# EAGLE design 2019_Dashboard_2_4_19 (EAGLE 9.1.0)
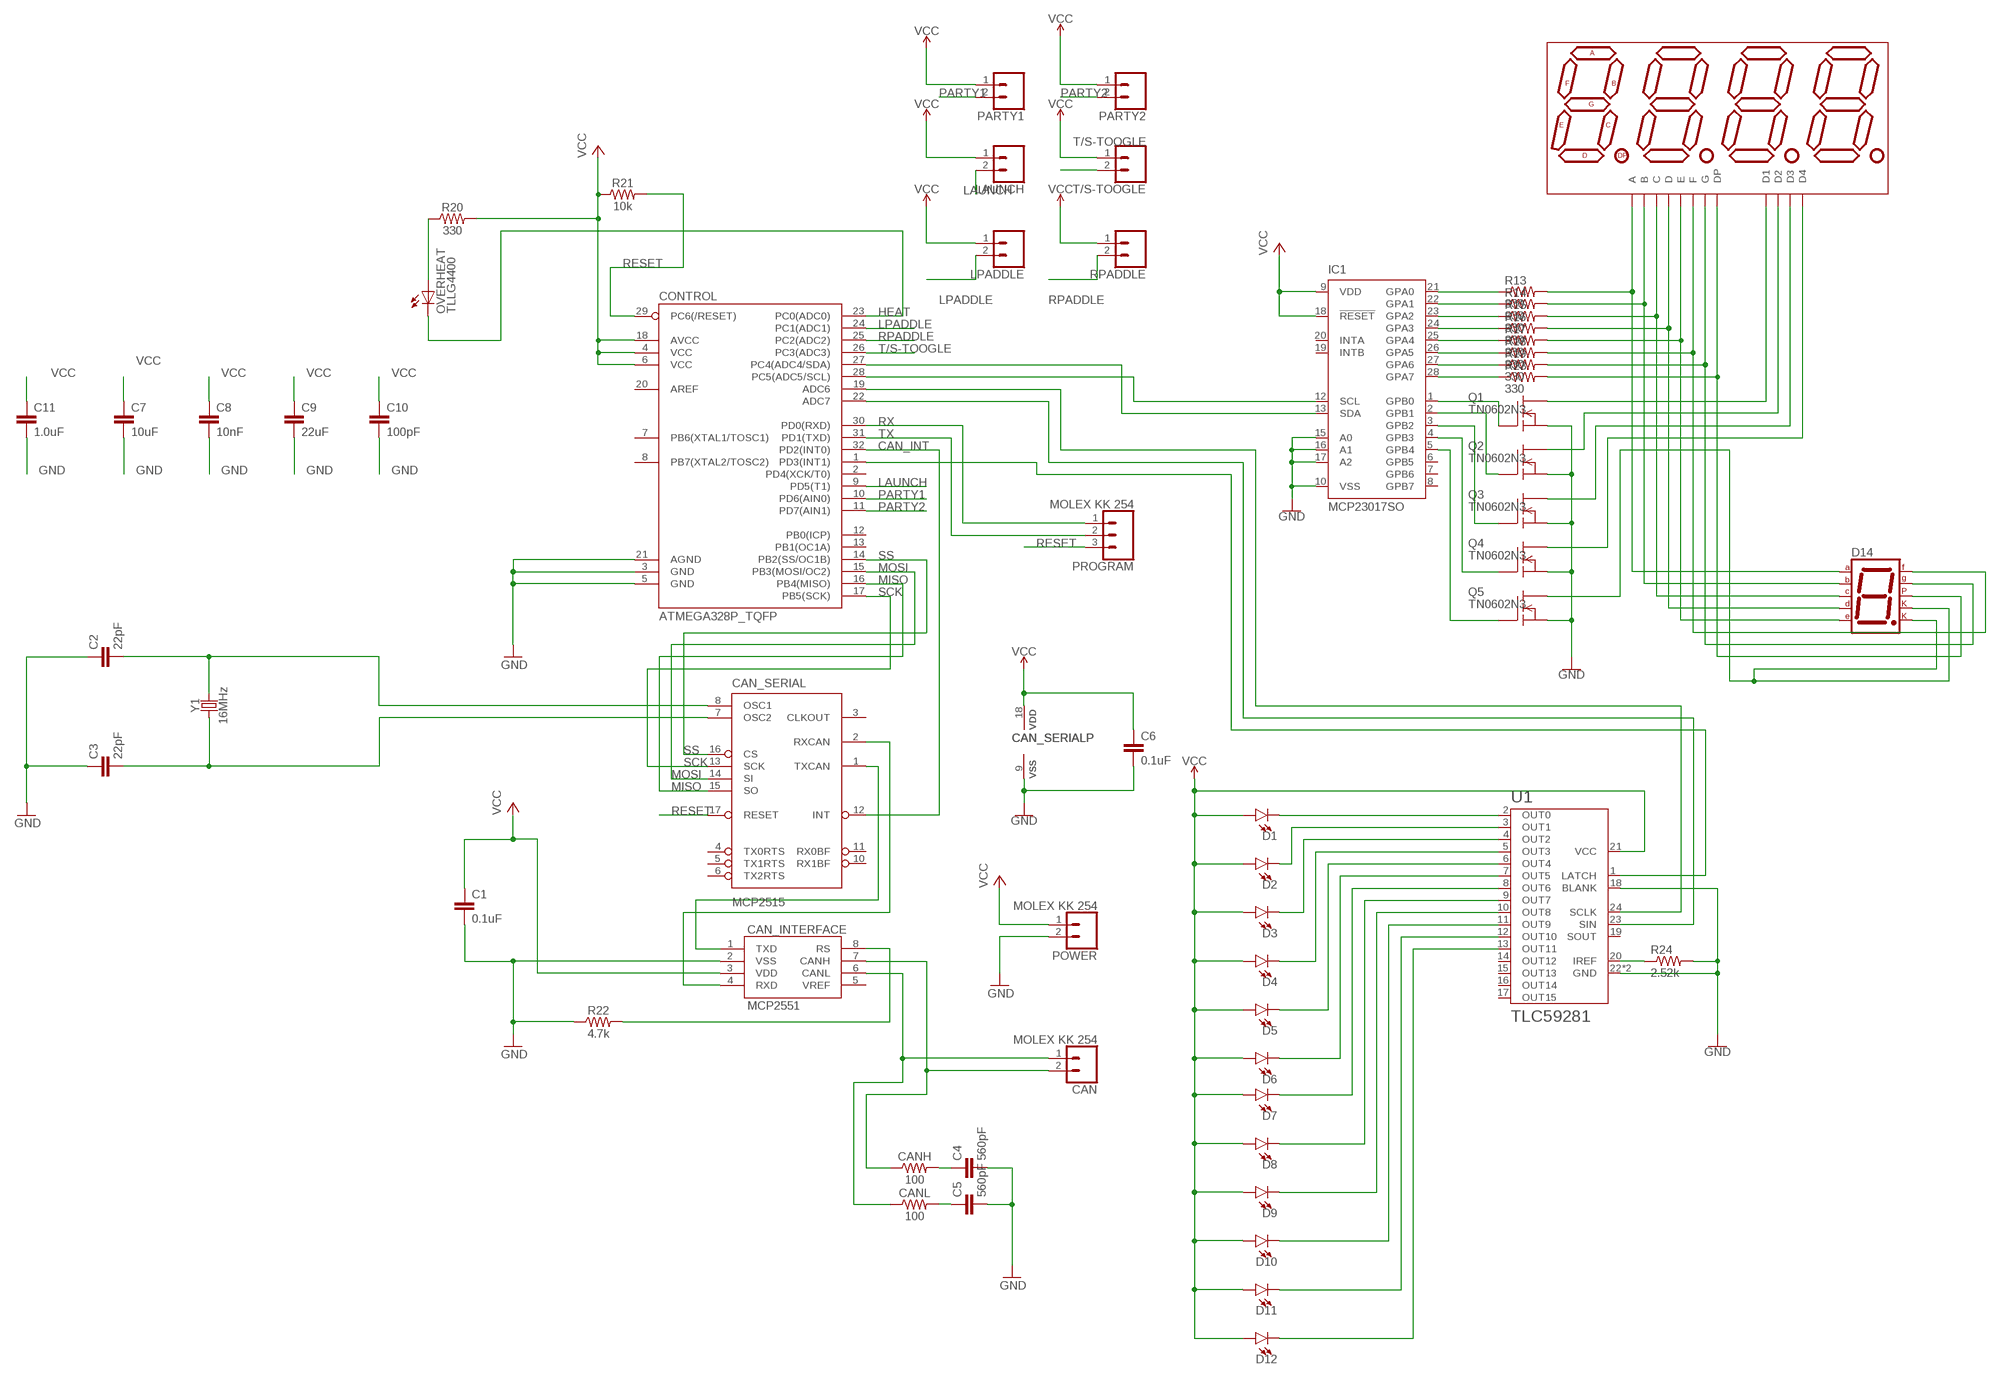
[diagram p0: schematic, sheet 1]

## Parts
C1  0.1uF  0.1UF-0603-25V-(+80/-20%)  [0603]
C2  22pF  22PF-0603-50V-5%  [0603]
C3  22pF  22PF-0603-50V-5%  [0603]
C4  560pF  560PF-0603-50V-5%  [0603]
C5  560pF  560PF-0603-50V-5%  [0603]
C6  0.1uF  0.1UF-0402-16V-10%  [0402]
C7  10uF  10UF-0805-10V-10%  [0805]
C8  10nF  10NF-0603-50V-10%  [0603]
C9  22uF  22UF-0805-6.3V-20%  [0805]
C10  100pF  100PF-0603-50V-5%  [0603]
C11  1.0uF  1.0UF-0805-25V-(+80/-20%)  [0805]
CAN  MOLEX KK 254  CONN_02  [1X02]
CAN_INTERFACE  MCP2551  [SO08]
CAN_SERIAL  MCP2515  MCP2515(MCP2510)SO  [SO18W]
CANH  100  100OHM-0603-1/4W-5%  [0603]
CANL  100  100OHM-0603-1/4W-5%  [0603]
CONTROL  ATMEGA328P_TQFP  [TQFP32-08]
D1  LED5MM  [LED_5MM]
D2  LED5MM  [LED_5MM]
D3  LED5MM  [LED_5MM]
D4  LED5MM  [LED_5MM]
D5  LED5MM  [LED_5MM]
D6  LED5MM  [LED_5MM]
D7  LED5MM  [LED_5MM]
D8  LED5MM  [LED_5MM]
D9  LED5MM  [LED_5MM]
D10  LED5MM  [LED_5MM]
D11  LED5MM  [LED_5MM]
D12  LED5MM  [LED_5MM]
D14  7SEG-CK  [7SEG-13]
DISP1  ATA8041ARBJ  7-SEGMENT-4DIGIT-20MM-RED  [7-SEGMENT-4DIGIT-20MM]
IC1  MCP23017SO  [SO28W]
LAUNCH  CONN_02LOCK  [1X02_LOCK]
LPADDLE  CONN_02LOCK  [1X02_LOCK]
OVERHEAT  TLLG4400  [LED3MM]
PARTY1  CONN_02LOCK  [1X02_LOCK]
PARTY2  CONN_02LOCK  [1X02_LOCK]
POWER  MOLEX KK 254  CONN_02  [1X02]
PROGRAM  MOLEX KK 254  CONN_03  [1X03]
Q1  TN0602N3  [TO-92]
Q2  TN0602N3  [TO-92]
Q3  TN0602N3  [TO-92]
Q4  TN0602N3  [TO-92]
Q5  TN0602N3  [TO-92]
R13  330  R-US_R0603  [R0603]
R14  330  R-US_R0603  [R0603]
R15  330  R-US_R0603  [R0603]
R16  330  R-US_R0603  [R0603]
R17  330  R-US_R0603  [R0603]
R18  330  R-US_R0603  [R0603]
R19  330  R-US_R0603  [R0603]
R20  330  330OHM-0603-1/10W-1%  [0603]
R21  10k  10KOHM-0603-1/10W-1%  [0603]
R22  4.7k  4.7KOHM-0603-1/10W-1%  [0603]
R23  330  R-US_R0603  [R0603]
R24  2.52k  R-US_R0603  [R0603]
RPADDLE  CONN_02LOCK  [1X02_LOCK]
T/S-TOOGLE  CONN_02LOCK  [1X02_LOCK]
U1  TLC59281  [QFN-24]
Y1  16MHz  CRYSTAL-16MHZPTH-HC49US  [HC49US]

## Nets
CAN_INT: CAN_SERIAL.12(INT) CONTROL.32(PD2(INT0))
CANH: CAN.2 CAN_INTERFACE.7(CANH) CANH.1
CANL: CAN.1 CAN_INTERFACE.6(CANL) CANL.1
CHI: C4.1 CANH.2
CI_SLOPE: CAN_INTERFACE.8(RS) R22.2
CLI: C5.1 CANL.2
GND [power]: C1.2 C2.1 C3.1 C4.2 C5.2 C6.2 C7.2 C8.2 C9.2 C10.2 C11.2 CAN_INTERFACE.2(VSS) CAN_SERIAL.9(VSS) CONTROL.3(GND) CONTROL.5(GND) CONTROL.21(AGND) IC1.10(VSS) IC1.15(A0) IC1.16(A1) IC1.17(A2) POWER.2 Q1.1(S) Q2.1(S) Q3.1(S) Q4.1(S) Q5.1(S) R22.1 R24.2 U1.18(BLANK) U1.22(GND) U1.EP(GND)
HEAT: CONTROL.23(PC0(ADC0)) OVERHEAT.K(C)
HEAT+: OVERHEAT.A R20.1
LAUNCH: CONTROL.9(PD5(T1)) LAUNCH.2
LPADDLE: CONTROL.24(PC1(ADC1)) LPADDLE.2
MISO: CAN_SERIAL.15(SO) CONTROL.16(PB4(MISO))
MOSI: CAN_SERIAL.14(SI) CONTROL.15(PB3(MOSI/OC2))
N$1: CONTROL.28(PC5(ADC5/SCL)) IC1.12(SCL)
N$2: CONTROL.27(PC4(ADC4/SDA)) IC1.13(SDA)
N$3 [led]: D14.7(A) DISP1.11(A) R13.2
N$4 [led]: D14.6(B) DISP1.7(B) R14.2
N$5 [led]: D14.4(C) DISP1.4(C) R15.2
N$6 [led]: D14.2(D) DISP1.2(D) R16.2
N$7 [led]: D14.1(E) DISP1.1(E) R17.2
N$8 [led]: D14.9(F) DISP1.10(F) R18.2
N$9 [led]: D14.10(G) DISP1.5(G) R19.2
N$10 [led]: D14.5(DP) DISP1.3(DP) R23.2
N$11 [led]: DISP1.12(D1) Q1.3(D)
N$12 [led]: DISP1.9(D2) Q2.3(D)
N$13 [led]: DISP1.8(D3) Q3.3(D)
N$14 [led]: DISP1.6(D4) Q4.3(D)
N$15 [led]: D14.3(CK1) D14.8(CK2) Q5.3(D)
N$18: CONTROL.19(ADC6) U1.24(SCLK)
N$19: CONTROL.22(ADC7) U1.23(SIN)
N$20: CONTROL.1(PD3(INT1)) U1.1(LATCH)
N$28: IC1.21(GPA0) R13.1
N$29: IC1.22(GPA1) R14.1
N$30: IC1.23(GPA2) R15.1
N$31: IC1.24(GPA3) R16.1
N$32: IC1.25(GPA4) R17.1
N$33: IC1.26(GPA5) R18.1
N$46: IC1.27(GPA6) R19.1
N$47: IC1.28(GPA7) R23.1
N$48: IC1.1(GPB0) Q1.2(G)
N$49: IC1.2(GPB1) Q2.2(G)
N$50: IC1.3(GPB2) Q3.2(G)
N$51: IC1.4(GPB3) Q4.2(G)
N$52: IC1.5(GPB4) Q5.2(G)
N$53: D1.K(C) U1.2(OUT0)
N$54: D2.K(C) U1.3(OUT1)
N$55: D3.K(C) U1.4(OUT2)
N$56: D4.K(C) U1.5(OUT3)
N$57: CAN_INTERFACE.1(TXD) CAN_SERIAL.1(TXCAN)
N$58: CAN_INTERFACE.4(RXD) CAN_SERIAL.2(RXCAN)
N$59: D5.K(C) U1.6(OUT4)
N$60: D6.K(C) U1.7(OUT5)
N$61: D7.K(C) U1.8(OUT6)
N$62: D8.K(C) U1.9(OUT7)
N$63: D9.K(C) U1.10(OUT8)
N$64: D10.K(C) U1.11(OUT9)
N$65: D11.K(C) U1.12(OUT10)
N$66: D12.K(C) U1.13(OUT11)
N$67: R24.1 U1.20(IREF)
OSC1: C2.2 CAN_SERIAL.8(OSC1) Y1.2
OSC2: C3.2 CAN_SERIAL.7(OSC2) Y1.1
PARTY1: CONTROL.10(PD6(AIN0)) PARTY1.2
PARTY2: CONTROL.11(PD7(AIN1)) PARTY2.2
RESET: CAN_SERIAL.17(RESET) CONTROL.29(PC6(/RESET)) PROGRAM.3 R21.2
RPADDLE: CONTROL.25(PC2(ADC2)) RPADDLE.2
RX: CONTROL.30(PD0(RXD)) PROGRAM.1
SCK: CAN_SERIAL.13(SCK) CONTROL.17(PB5(SCK))
SS: CAN_SERIAL.16(CS) CONTROL.14(PB2(SS/OC1B))
T/S-TOOGLE: CONTROL.26(PC3(ADC3)) T/S-TOOGLE.2
TX: CONTROL.31(PD1(TXD)) PROGRAM.2
VCC [power]: C1.1 C6.1 C7.1 C8.1 C9.1 C10.1 C11.1 CAN_INTERFACE.3(VDD) CAN_SERIAL.18(VDD) CONTROL.4(VCC) CONTROL.6(VCC) CONTROL.18(AVCC) D1.A D2.A D3.A D4.A D5.A D6.A D7.A D8.A D9.A D10.A D11.A D12.A IC1.9(VDD) IC1.18(!RESET) LAUNCH.1 LPADDLE.1 PARTY1.1 PARTY2.1 POWER.1 R20.2 R21.1 RPADDLE.1 T/S-TOOGLE.1 U1.21(VCC)
Unconnected: CAN_INTERFACE.5(VREF) CAN_SERIAL.3(CLKOUT) CAN_SERIAL.4(TX0RTS) CAN_SERIAL.5(TX1RTS) CAN_SERIAL.6(TX2RTS) CAN_SERIAL.10(RX1BF) CAN_SERIAL.11(RX0BF) CONTROL.2(PD4(XCK/T0)) CONTROL.7(PB6(XTAL1/TOSC1)) CONTROL.8(PB7(XTAL2/TOSC2)) CONTROL.12(PB0(ICP)) CONTROL.13(PB1(OC1A)) CONTROL.20(AREF) IC1.6(GPB5) IC1.7(GPB6) IC1.8(GPB7) IC1.19(INTB) IC1.20(INTA) U1.14(OUT12) U1.15(OUT13) U1.16(OUT14) U1.17(OUT15) U1.19(SOUT)

## Library data of the parts
C1 = SparkFun-Capacitors:0.1UF: 0.1µF ceramic capacitors A capacitor is a passive two-terminal electrical component used to store electrical energy temporarily in an electric field.; PROD_ID: CAP-00810
C2 C3 = SparkFun-Capacitors:22PF: 22pF ceramic capacitors A capacitor is a passive two-terminal electrical component used to store electrical energy temporarily in an electric field.; PROD_ID: CAP-07876
C4 C5 = SparkFun-Capacitors:560PF: 0.56nF/560pF ceramic capacitors A capacitor is a passive two-terminal electrical component used to store electrical energy temporarily in an electric field.; PROD_ID: CAP-08749
C6 = SparkFun-Capacitors:0.1UF: 0.1µF ceramic capacitors A capacitor is a passive two-terminal electrical component used to store electrical energy temporarily in an electric field.; PROD_ID: CAP-12416
C7 = SparkFun-Capacitors:10UF: 10.0µF ceramic capacitors A capacitor is a passive two-terminal electrical component used to store electrical energy temporarily in an electric field.; PROD_ID: CAP-11330
C8 = SparkFun-Capacitors:10NF: 0.01uF/10nF/10,000pF ceramic capacitors A capacitor is a passive two-terminal electrical component used to store electrical energy temporarily in an electric field. CAP-09321; PROD_ID: CAP-00867
C9 = SparkFun-Capacitors:22UF: 22µF ceramic capacitors A capacitor is a passive two-terminal electrical component used to store electrical energy temporarily in an electric field.; PROD_ID: CAP-08402
C10 = SparkFun-Capacitors:100PF: 100pF/0.1nF ceramic capacitors A capacitor is a passive two-terminal electrical component used to store electrical energy temporarily in an electric field.; PROD_ID: CAP-07883
C11 = SparkFun-Capacitors:1.0UF: 1µF ceramic capacitors A capacitor is a passive two-terminal electrical component used to store electrical energy temporarily in an electric field.; PROD_ID: CAP-11625
CAN LAUNCH LPADDLE PARTY1 PARTY2 POWER RPADDLE T/S-TOOGLE = SparkFun-Connectors:CONN_02: Multi connection point. Often used as Generic Header-pin footprint for 0.1 inch spaced/style header connections On any of the 0.1 inch spaced packages, you can populate with these: Break Away Headers - Straight <https://www.sparkfun.com/products/116> (PRT-00116) Break Away Male Headers - Right Angle <https://www.sparkfun.com/products/553> (PRT-00553) Female Headers <https://www.sparkfun.com/products/115> (PRT-00115) Break Away Headers - Machine Pin <https://www.sparkfun.com/products/117> (PRT-00117) Break Away Female Headers - Swiss Machine Pin <https://www.sparkfun.com/products/743> (PRT-00743) For SCREWTERMINALS and SPRING TERMINALS visit here: Screw Terimnals on SparkFun.com <https://www.sparkfun.com/search/results?term=Screw+Terminals> (5mm/3.5mm/2.54mm spacing) This device is also useful as a general connection point to wire up your design to another part of your project. Our various solder wires solder well into these plated through hole pads. Hook-Up Wire - Assortment (Stranded, 22 AWG) <https://www.sparkfun.com/products/11375> (PRT-11375) Hook-Up Wire - Assortment (Solid Core, 22 AWG) <https://www.sparkfun.com/products/11367> (PRT-11367) View the entire wire category on our website here <https://www.sparkfun.com/categories/141> Special notes: Molex polarized connector foot print use with: PRT-08233 with associated crimp pins and housings. 2.54_SCREWTERM for use with PRT-10571. 3.5mm Screw Terminal footprints for PRT-08084 5mm Screw Terminal footprints for use with PRT-08432
CAN_INTERFACE = SparkFun-IC-Comms:MCP2551: MCP2551 High Speed CAN Transceiver High speed CAN transceiver Datasheet <http://www.sparkfun.com/datasheets/DevTools/Arduino/MCP2551.pdf> SparkFun Products CAN-BUS Shield <https://www.sparkfun.com/products/13262> (DEV-13262) SparkFun OBD-II UART <https://www.sparkfun.com/products/9555> (WIG-09555); PROD_ID: IC-09907
CAN_SERIAL = SparkFun-IC-Comms:MCP2515(MCP2510): CAN controller with SPI interface The MCP2515 controller supercedes the MCP2510 while addressing all errata associated with it. The two devices are pin compatible, either can be used with this device. 18-pin package SOIC Simple SPI interface to any MCU. One-shot mode ensures message transmission is attempted only once Databyte filtering Start-of-Frame (SOF) output Low-power CMOS Technology Datasheet <http://www.sparkfun.com/datasheets/DevTools/Arduino/MCP2515.pdf> SparkFun Products CAN-BUS Shield <https://www.sparkfun.com/products/13262> (DEV-13262); PROD_ID: IC-09906
CANH CANL = SparkFun-Resistors:100OHM: 100Ω resistor A resistor is a passive two-terminal electrical component that implements electrical resistance as a circuit element. Resistors act to reduce current flow, and, at the same time, act to lower voltage levels within circuits. - Wikipedia; PROD_ID: RES-12438
CONTROL = SparkFun-IC-Microcontroller:ATMEGA328P_TQFP: Popular 328P in QFP Storefront component: ATmega328 - TQFP <https://www.sparkfun.com/products/13448> (COM-13448) Datasheet <http://www.sparkfun.com/datasheets/Components/SMD/ATMega328.pdf> SparkFun Products SparkFun RedBoard - Programmed with Arduino <https://www.sparkfun.com/products/12757> (DEV-12757) Arduino Pro Mini 328 - 5V/16MHz <https://www.sparkfun.com/products/11113> (DEV-11113) Arduino Pro Mini 328 - 3.3V/8MHz <https://www.sparkfun.com/products/11114> (DEV-11114) SparkFun OpenLog <https://www.sparkfun.com/products/13712> (DEV-13712) SparkFun MicroView - OLED Arduino Module <https://www.sparkfun.com/products/12923> (DEV-12923) SparkFun Digital Sandbox <https://www.sparkfun.com/products/12651> (DEV-12651) SparkFun PicoBoard <https://www.sparkfun.com/products/11888> (WIG-11888) Arduino Fio <https://www.sparkfun.com/products/10116> (DEV-10116) LilyPad Arduino 328 Main Board <https://www.sparkfun.com/products/13342> (DEV-13342) SparkFun RedStick <https://www.sparkfun.com/products/13741> (DEV-13741) LilyPad MP3 <https://www.sparkfun.com/products/11013> (DEV-11013) LilyPad Arduino SimpleSnap <https://www.sparkfun.com/products/10941> (DEV-10941) SparkFun Stepoko <https://www.sparkfun.com/products/13899> (ROB-13899) SparkFun Geiger Counter <https://www.sparkfun.com/products/11345> (SEN-11345) SparkFun EL Sequencer <https://www.sparkfun.com/products/12781> (COM-12781) Arduino Pro 328 - 5V/16MHz <https://www.sparkfun.com/products/10915> (DEV-10915) CryptoCape <https://www.sparkfun.com/products/12773> (DEV-12773) SparkFun IR Thermometer Evaluation Board - MLX90614 <https://www.sparkfun.com/products/10740> (SEN-10740) SparkFun RedBot Mainboard <https://www.sparkfun.com/products/12097> (ROB-12097) Arduino Pro 328 - 3.3V/8MHz <https://www.sparkfun.com/products/10914> (DEV-10914) SparkFun Block for Intel® Edison - Arduino <https://www.sparkfun.com/products/13036> (DEV-13036) SparkFun Simon Says - Surface Mount Soldering Kit <https://www.sparkfun.com/products/10935> (KIT-10935) SparkFun 7-Segment Serial Display - Red <https://www.sparkfun.com/products/11441> (COM-11441) SparkFun 7-Segment Serial Display - White <https://www.sparkfun.com/products/11629> (COM-11629) SparkFun 7-Segment Serial Display - Yellow <https://www.sparkfun.com/products/11443> (COM-11443) SparkFun 7-Segment Serial Display - Kelly Green <https://www.sparkfun.com/products/11440> (COM-11440) SparkFun 7-Segment Serial Display - Blue <https://www.sparkfun.com/products/11442> (COM-11442) SparkFun OpenSegment Serial Display - 20mm (Blue) <https://www.sparkfun.com/products/11647> (COM-11647) SparkFun OpenSegment Serial Display - 20mm (Green) <https://www.sparkfun.com/products/11646> (COM-11646) SparkFun OpenSegment Serial Display - 20mm (White) <https://www.sparkfun.com/products/11648> (COM-11648) SparkFun OpenSegment Serial Display - 20mm (Red) <https://www.sparkfun.com/products/11644> (COM-11644) SparkFun OpenSegment Serial Display - 20mm (Yellow) <https://www.sparkfun.com/products/11645> (COM-11645) SparkFun OpenSegment Shield <https://www.sparkfun.com/products/13190> (DEV-13190); PROD_ID: IC-09069
D1-D12 = SparkFun-LED:LED: LED (Generic) Standard schematic elements and footprints for 5mm, 3mm, 1206, and 0603 sized LEDs. Generic LEDs with no color specified.
D14 = special:7SEG-CK: 7-segment DISPLAY single cathode, 13 mm
DISP1 = SparkFun-LED:7-SEGMENT-4DIGIT-20MM: 4 Digit 7 Segment Display This is a part for the 4-Digit 7-segment LEDs from Young Sun. Different from the Digikey LEDs, all 16 pins are used. The LONGPADS Variant is used for a test jig, but you may like it because there is more pad to solder to. If you are concerned about routing space, the standard works just fine though. Datasheets: Red <http://cdn.sparkfun.com/datasheets/Components/LED/1LEDREDCC.pdf> Yellow <http://cdn.sparkfun.com/datasheets/Components/LED/1LEDYELCC.pdf> Green <http://cdn.sparkfun.com/datasheets/Components/LED/1LEDGRNCC.pdf> Blue <http://cdn.sparkfun.com/datasheets/Components/LED/1LEDBLUCC.pdf> White <http://cdn.sparkfun.com/datasheets/Components/LED/1LEDWHTCC.pdf> SparkFun Products Raw Components 7-Segment Display - 20mm (Red) <https://www.sparkfun.com/products/11405> (COM-11405) 7-Segment Display - 20mm (Yellow) <https://www.sparkfun.com/products/11406> (COM-11406) 7-Segment Display - 20mm (Green) <https://www.sparkfun.com/products/11407> (COM-11407) 7-Segment Display - 20mm (Blue) <https://www.sparkfun.com/products/11408> (COM-11408) 7-Segment Display - 20mm (White) <https://www.sparkfun.com/products/11409> (COM-11409) Serial Controlled SparkFun OpenSegment Serial Display - 20mm (Red) <https://www.sparkfun.com/products/11644> (COM-11644) SparkFun OpenSegment Serial Display - 20mm (Yellow) <https://www.sparkfun.com/products/11645> (COM-11645) SparkFun OpenSegment Serial Display - 20mm (Green) <https://www.sparkfun.com/products/11646> (COM-11646) SparkFun OpenSegment Serial Display - 20mm (Blue) <https://www.sparkfun.com/products/11647> (COM-11647) SparkFun OpenSegment Serial Display - 20mm (White) <https://www.sparkfun.com/products/11648> (COM-11648) Other SparkFun OpenSegment Shield <https://www.sparkfun.com/products/13190> (DEV-13190); PROD_ID: COMP-11449
IC1 = adafruit:MCP23017: http://ww1.microchip.com/downloads/en/DeviceDoc/21952a.pdf Source: http://ww1.microchip.com/downloads/en/DeviceDoc/21952a.pdf
OVERHEAT = led:TLLG4400: Low Current (2mA) LED 3 mm Tinted Diffused Package color GREEN Source: Data sheet <http://www.farnell.com/datasheets/391098.pdf>; MF: VISHAY SEMICONDUCTOR; OC_FARNELL: 1612435
PROGRAM = SparkFun-Connectors:CONN_03: Multi connection point. Often used as Generic Header-pin footprint for 0.1 inch spaced/style header connections On any of the 0.1 inch spaced packages, you can populate with these: Break Away Headers - Straight <https://www.sparkfun.com/products/116> (PRT-00116) Break Away Male Headers - Right Angle <https://www.sparkfun.com/products/553> (PRT-00553) Female Headers <https://www.sparkfun.com/products/115> (PRT-00115) Break Away Headers - Machine Pin <https://www.sparkfun.com/products/117> (PRT-00117) Break Away Female Headers - Swiss Machine Pin <https://www.sparkfun.com/products/743> (PRT-00743) Stackable Header - 3 Pin (Female, 0.1") <https://www.sparkfun.com/products/13875> (PRT-13875) For SCREWTERMINALS and SPRING TERMINALS visit here: Screw Terimnals on SparkFun.com <https://www.sparkfun.com/search/results?term=Screw+Terminals> (5mm/3.5mm/2.54mm spacing) This device is also useful as a general connection point to wire up your design to another part of your project. Our various solder wires solder well into these plated through hole pads. Hook-Up Wire - Assortment (Stranded, 22 AWG) <https://www.sparkfun.com/products/11375> (PRT-11375) Hook-Up Wire - Assortment (Solid Core, 22 AWG) <https://www.sparkfun.com/products/11367> (PRT-11367) View the entire wire category on our website here <https://www.sparkfun.com/categories/141> Special notes: Molex polarized connector foot print use with SKU : PRT-08232 with associated crimp pins and housings.
Q1-Q5 = transistor-fet:TN0602N3: N-Channel Enhancement MOSFET 20V; 4A; 0,75Ohm
R13-R19 R23 R24 = resistor:R-US_: RESISTOR, American symbol
R20 = SparkFun-Resistors:330OHM: 330Ω resistor A resistor is a passive two-terminal electrical component that implements electrical resistance as a circuit element. Resistors act to reduce current flow, and, at the same time, act to lower voltage levels within circuits. - Wikipedia; PROD_ID: RES-00818
R21 = SparkFun-Resistors:10KOHM: 10kΩ resistor A resistor is a passive two-terminal electrical component that implements electrical resistance as a circuit element. Resistors act to reduce current flow, and, at the same time, act to lower voltage levels within circuits. - Wikipedia; PROD_ID: RES-00824
R22 = SparkFun-Resistors:4.7KOHM: 4.7kΩ resistor A resistor is a passive two-terminal electrical component that implements electrical resistance as a circuit element. Resistors act to reduce current flow, and, at the same time, act to lower voltage levels within circuits. - Wikipedia; PROD_ID: RES-07857
U1 = TLC59281:TLC59281; AVAILABILITY: Unavailable; DESCRIPTION: 16-Channel Constant-Current LED Driver without LED Open Detection; MF: Texas Instruments; MP: TLC59281; PACKAGE: None; PRICE: None
Y1 = SparkFun-Clocks:CRYSTAL-16MHZ: 16MHz Crystal Digikey Example <http://www.digikey.com/product-search/en?keywords=535-9122-1-ND> Frequency: 16MHz Frequency Stability: ±50ppm Frequency Tolerance: ±20ppm Load Capacitance: 18pF SparkFun Products: Pro Micro -5V/16MHz <https://www.sparkfun.com/products/12640> SparkFun Serial Enabled LCD Kit <https://www.sparkfun.com/products/10097>; PROD_ID: XTAL-08181; SF_ID: COM-00536

## Net classes
1 power: width 0.406 mm
2 led: width 0.203 mm

## Board
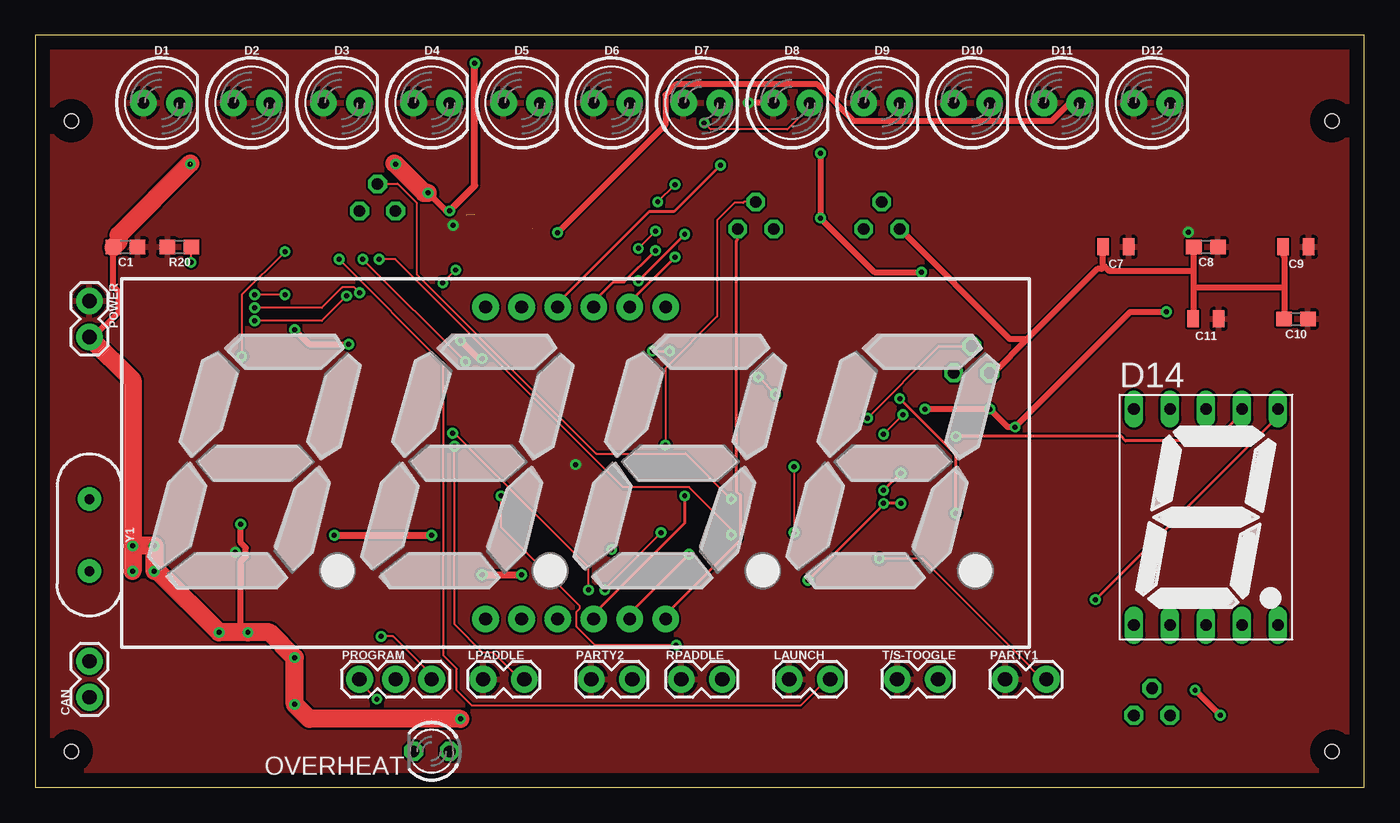
[diagram p1: board, top side]
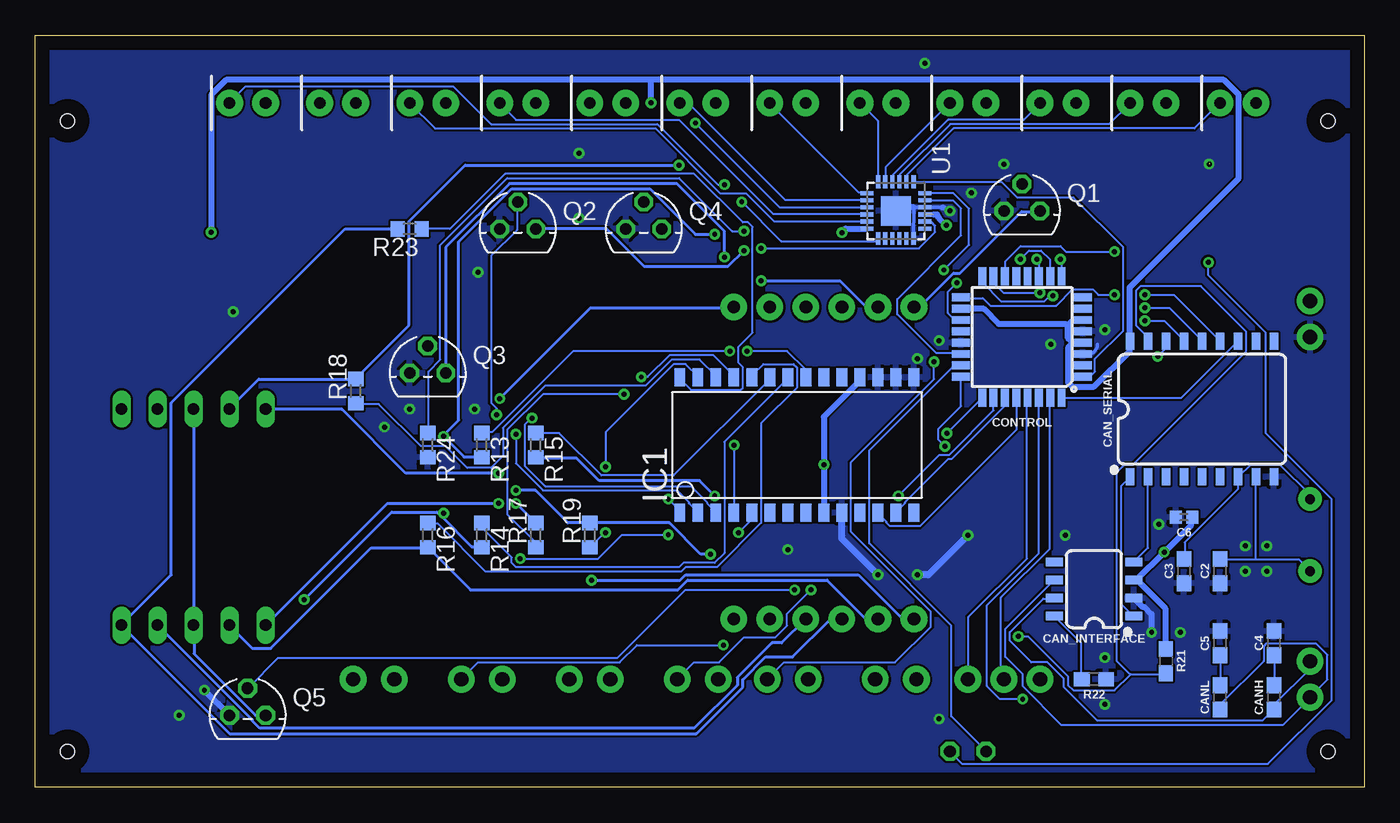
[diagram p2: board, bottom side, seen from below]

Size 93.71 x 53.01 mm. Coordinates in mm from the lower left corner, seen from the top.
Outline: 0,0 93.71,0 93.71,53.01 0,53.01 0,0
Copper layers (1*16): Top 0.035mm / dielectric 1.5mm / Bottom 0.035mm
Design rules "default": minimum track width 6mil, minimum drill 0.35mm, track to track 6mil, track to pad 6mil, pad to pad 6mil, via to via 6mil, smd to smd 6mil, copper to edge 40mil, drill to drill 6mil, minimum pad ring 10mil, minimum via ring 8mil, stop-mask expansion 4mil, vias tented up to drill 0mil, thermal gap 10mil
Holes 1 mm at 91.44,46.99 2.54,2.54 2.54,46.99 91.44,2.54

### Footprints (pad centres in the part's own frame; a part is rotated, then mirrored left to right if it is on the bottom)
0603 = smd 1.1 x 1: 1 -0.85,0; 2 0.85,0
0402 = smd 0.85 x 0.9: 1 -0.58,0; 2 0.58,0
0805 = smd 0.8 x 1.2: 1 -0.9,0; 2 0.9,0
1X02 = drill 1.016 pad 1.88: 1 0,0; 2 2.54,0
SO08 = smd 0.6 x 1.2: 1 -1.905,-2.8; 2 -0.635,-2.8; 3 0.635,-2.8; 4 1.905,-2.8; 5 1.905,2.8; 6 0.635,2.8; 7 -0.635,2.8; 8 -1.905,2.8
SO18W = smd 0.6 x 1.2: 1 -5.08,-4.788; 2 -3.81,-4.788; 3 -2.54,-4.788; 4 -1.27,-4.788; 5 0,-4.788; 6 1.27,-4.788; 7 2.54,-4.788; 8 3.81,-4.788; 9 5.08,-4.788; 10 5.08,4.788; 11 3.81,4.788; 12 2.54,4.788; 13 1.27,4.788; 14 0,4.788; 15 -1.27,4.788; 16 -2.54,4.788; 17 -3.81,4.788; 18 -5.08,4.788
TQFP32-08 = smd 1.27 x 0.559: 1 -4.293,2.8; 2 -4.293,2; 3 -4.293,1.2; 4 -4.293,0.4; 5 -4.293,-0.4; 6 -4.293,-1.2; 7 -4.293,-2; 8 -4.293,-2.8; 17 4.293,-2.8; 18 4.293,-2; 19 4.293,-1.2; 20 4.293,-0.4; 21 4.293,0.4; 22 4.293,1.2; 23 4.293,2; 24 4.293,2.8 | smd 0.559 x 1.27: 9 -2.8,-4.293; 10 -2,-4.293; 11 -1.2,-4.293; 12 -0.4,-4.293; 13 0.4,-4.293; 14 1.2,-4.293; 15 2,-4.293; 16 2.8,-4.293; 25 2.8,4.293; 26 2,4.293; 27 1.2,4.293; 28 0.4,4.293; 29 -0.4,4.293; 30 -1.2,4.293; 31 -2,4.293; 32 -2.8,4.293
LED_5MM = drill 0.813 pad 1.88: A -1.27,0; K 1.27,0
7SEG-13 = drill 0.813 long: 1 -5.08,-7.62; 2 -2.54,-7.62; 3 0,-7.62; 4 2.54,-7.62; 5 5.08,-7.62; 6 5.08,7.62; 7 2.54,7.62; 8 0,7.62; 9 -2.54,7.62; 10 -5.08,7.62
7-SEGMENT-4DIGIT-20MM = drill 0.9 pad 1.88: 1 -6.35,-10.998; 2 -3.81,-10.998; 3 -1.27,-10.998; 4 1.27,-10.998; 5 3.81,-10.998; 6 6.35,-10.998; 7 6.35,10.998; 8 3.81,10.998; 9 1.27,10.998; 10 -1.27,10.998; 11 -3.81,10.998; 12 -6.35,10.998
SO28W = smd 0.762 x 1.27: 1 -7.62,-4.78; 2 -6.35,-4.78; 3 -5.08,-4.78; 4 -3.81,-4.78; 5 -2.54,-4.78; 6 -1.27,-4.78; 7 0,-4.78; 8 1.27,-4.78; 9 2.54,-4.78; 10 3.81,-4.78; 11 5.08,-4.78; 12 6.35,-4.78; 13 7.62,-4.78; 14 8.89,-4.78; 15 8.89,4.78; 16 7.62,4.78; 17 6.35,4.78; 18 5.08,4.78; 19 3.81,4.78; 20 2.54,4.78; 21 1.27,4.78; 22 0,4.78; 23 -1.27,4.78; 24 -2.54,4.78; 25 -3.81,4.78; 26 -5.08,4.78; 27 -6.35,4.78; 28 -7.62,4.78
1X02_LOCK = drill 1.016 pad 1.88: 1 -0.178,0; 2 2.718,0
LED3MM = drill 0.813 octagon: A -1.27,0; K 1.27,0
1X03 = drill 1.016 pad 1.88: 1 0,0; 2 2.54,0; 3 5.08,0
TO-92 = drill 0.813 octagon: 1 -1.27,0; 2 0,1.905; 3 1.27,0
R0603 = smd 1 x 1.1: 1 -0.85,0; 2 0.85,0
QFN-24 = smd 0.9 x 0.3: 1 -2.05,1.25; 2 -2.05,0.75; 3 -2.05,0.25; 4 -2.05,-0.25; 5 -2.05,-0.75; 6 -2.05,-1.25; 13 1.95,-1.25; 14 1.95,-0.75; 15 1.95,-0.25; 16 1.95,0.25; 17 1.95,0.75; 18 1.95,1.25 | smd 0.3 x 0.9: 7 -1.25,-2.05; 8 -0.75,-2.05; 9 -0.25,-2.05; 10 0.25,-2.05; 11 0.75,-2.05; 12 1.25,-2.05; 19 1.25,2.05; 20 0.75,2.05; 21 0.25,2.05; 22 -0.25,2.05; 23 -0.75,2.05; 24 -1.25,2.05 | smd 2.1 x 2.1: EP 0,0
HC49US = drill 0.7 pad 1.651: 1 -2.54,0; 2 2.54,0

### Placement (x,y rotation side)
C1  6.35,38.1 180 top
C2  10.16,15.24 90 bottom
C3  12.7,15.24 90 bottom
C4  6.35,10.16 90 bottom
C5  10.16,10.16 90 bottom
C6  12.7,19.05 180 bottom
C7  76.2,38.1 180 top
C8  82.55,38.1 180 top
C9  88.9,38.1 180 top
C10  88.9,33.02 180 top
C11  82.55,33.02 180 top
CAN  3.81,6.35 90 top
CAN_INTERFACE  19.05,13.97 90 bottom
CAN_SERIAL  11.43,26.67 0 bottom
CANH  6.35,6.35 90 bottom
CANL  10.16,6.35 90 bottom
CONTROL  24.13,31.75 180 bottom
D1  8.89,48.26 0 top
D2  15.24,48.26 0 top
D3  21.59,48.26 0 top
D4  27.94,48.26 0 top
D5  34.29,48.26 0 top
D6  40.64,48.26 0 top
D7  46.99,48.26 0 top
D8  53.34,48.26 0 top
D9  59.69,48.26 0 top
D10  66.04,48.26 0 top
D11  72.39,48.26 0 top
D12  78.74,48.26 0 top
D14  82.55,19.05 0 top
DISP1  38.1,22.86 0 top
IC1  40.64,24.13 0 bottom
LAUNCH  53.34,7.62 0 top
LPADDLE  31.75,7.62 0 top
OVERHEAT  27.94,2.54 180 top
PARTY1  68.58,7.62 0 top
PARTY2  39.37,7.62 0 top
POWER  3.81,34.29 270 top
PROGRAM  22.86,7.62 0 top
Q1  24.13,40.64 0 bottom
Q2  59.69,39.37 0 bottom
Q3  66.04,29.21 0 bottom
Q4  50.8,39.37 0 bottom
Q5  78.74,5.08 0 bottom
R13  62.23,24.13 270 bottom
R14  62.23,17.78 270 bottom
R15  58.42,24.13 270 bottom
R16  66.04,17.78 270 bottom
R17  58.42,17.78 90 bottom
R18  71.12,27.94 90 bottom
R19  54.61,17.78 90 bottom
R20  10.16,38.1 180 top
R21  13.97,8.89 270 bottom
R22  19.05,7.62 180 bottom
R23  67.31,39.37 180 bottom
R24  66.04,24.13 270 bottom
RPADDLE  45.72,7.62 0 top
T/S-TOOGLE  60.96,7.62 0 top
U1  33.02,40.64 270 bottom
Y1  3.81,17.78 270 top

### Tracks (layer width: path | path; a pad name or v marks a point on that pad's centre or on a via)
CAN_INT
  Bottom 0.152: CAN_SERIAL.12 8.91,31.45 12.88,27.48 21.26,27.48 CONTROL.32
CANH
  Bottom 0.152: CAN.2 3.81,8.36 6.33,5.84 6.33,5.54 CANH.1 6.4,5.46 7.16,4.7 18.82,4.7 21.18,7.06 21.18,7.67 22.33,8.81 23.47,8.81 24.99,10.34 24.99,10.95 22.63,13.31 21.87,13.31 CAN_INTERFACE.7
CANL
  Bottom 0.152: CANL.1 10.13,5.54 10.13,5.84 7.09,8.89 7.09,9.96 6.93,10.11 3.35,10.11 2.59,9.35 2.59,7.59 3.81,6.38 CAN.1 3.81,6.3 5.72,4.39 21.34,4.39 24.08,7.14 24.08,7.98 25.3,9.2 25.3,11.18 21.87,14.6 CAN_INTERFACE.6
CHI
  Bottom 0.152: CANH.2 6.33,7.21 6.33,9.27 C4.1
CI_SLOPE
  Bottom 0.152: R22.2 19.96,7.67 19.96,10.19 21.79,12.01 CAN_INTERFACE.8
CLI
  Bottom 0.152: CANL.2 10.13,7.21 10.13,9.27 C5.1
GND  (via drill 0.35)  (1 unrouted)
  Top 0.406: POWER.2 4.04,31.75 4.8,32.51 4.88,32.51 5.87,33.5 5.87,34.95 5.49,35.33 5.49,38.07 C1.2 | 88.09,35.26 88.09,37.39 88.01,37.46 88.01,38.07 C9.2 | 88.09,35.26 88.09,33.05 C10.2 | 81.69,35.26 81.69,33.05 C11.2 | 81.69,35.26 81.69,36.4 | 81.69,36.4 81.69,38.07 C8.2 | 75.4,36.74 75.74,36.4 81.69,36.4 | 75.4,36.74 75.29,36.85 75.29,38.07 C7.2 | 81.69,35.26 88.09,35.26 | 69.98,31.62 74.91,36.55 75.21,36.55 75.4,36.74 | 69.98,31.62 67.59,29.23 67.36,29.23 Q3.1 | Q2.1 68.71,31.62 69.98,31.62 | v29.21,40.64 28.96,40.64 v27.69,41.91 | v62.48,36.32 59.18,36.32 v55.37,40.13 v55.37,44.7 | v14.99,10.92 14.48,11.43 14.48,15.93 14.83,16.28 14.83,16.89 14.48,17.24 v14.48,18.54 | v18.29,32.26 19.3,31.24 v22.1,31.24 | v62.74,26.67 v67.31,26.67 68.58,25.4 v69.09,25.4 77.22,33.53 v79.76,33.53 | v81.79,6.86 v83.57,5.08 | v31.5,30.23 31.24,30.23 v29.97,31.5
  Top 0.508: v21.08,17.78 v27.94,17.78 | v31.5,14.99 v34.29,14.99 | v29.21,40.64 30.99,42.42 v30.99,51.05
  Top 1.27: v6.86,17.02 v6.86,15.24 | v6.86,17.02 v8.38,17.02 v8.38,15.24 8.64,15.24 v12.95,10.92 v14.99,10.92 16.51,10.92 v18.29,9.14 v18.29,5.84 19.3,4.83 v29.97,4.83 | POWER.2 6.86,28.7 v6.86,17.02 | v27.69,41.91 27.41,41.91 25.33,43.99 | 5.49,38.07 5.86,38.45 5.86,38.93 10.93,43.99
  Bottom 0.254: U1.18 31.75,40.89 U1.22 29.72,40.89 | 19.49,30.55 arc-90 18.8,31.24
  Bottom 0.406: 31.75,40.89 32.77,40.89 U1.EP | v29.21,40.64 29.72,40.89 arc90 29.72,40.89 | CONTROL.3 19.49,30.55 | CAN_INTERFACE.2 15.64,12.72 15.5,12.72 14.99,12.2 v14.99,10.92 | Q5.1 v81.79,6.86
  Bottom 0.508: v27.94,17.78 30.73,14.99 v31.5,14.99 | v34.29,14.99 36.83,17.53 IC1.10
  other vias: 40.64,16.76 10.92,43.94 25.4,43.94
  pour Bottom: 0,53.34 0,0 93.98,0 93.98,53.34
HEAT
  Bottom 0.152: CONTROL.23 28.42,29.69 28.96,29.69 34.9,23.75 34.9,17.2 29.11,11.41 29.11,5 26.67,2.56 OVERHEAT.K
HEAT+  (via drill 0.35)
  Top 0.152: v10.97,37.01 10.97,38.07 R20.1
  Bottom 0.152: v10.97,37.01 10.97,36.09 6.93,32.05 6.93,24.97 2.29,20.32 2.29,6.15 6.78,1.65 28.35,1.65 29.19,2.49 OVERHEAT.A
LAUNCH  (via drill 0.35)
  Top 0.152: v21.41,37.24 28.8,29.84 28.8,9.27 29.72,8.36 29.72,6.83 30.78,5.77 53.95,5.77 55.78,7.59 56.01,7.59 LAUNCH.2
  Bottom 0.152: v21.41,37.24 21.34,37.16 21.34,36.09 CONTROL.9
LPADDLE  (via drill 0.35)
  Top 0.152: v29.57,24.05 29.57,11.48 31.55,9.5 32.31,9.5 34.14,7.67 34.44,7.67 LPADDLE.2
  Bottom 0.152: CONTROL.24 28.42,26.87 30.02,25.27 30.02,24.51 v29.57,24.05
MISO  (via drill 0.35)
  Top 0.152: v15.47,32.89 20.19,32.89 v21.95,34.65
  Bottom 0.152: v15.47,32.89 14.1,32.89 12.73,31.52 CAN_SERIAL.15 | v21.95,34.65 22.17,34.65 22.56,34.27 25.6,34.27 26.9,35.56 26.9,36.02 CONTROL.16
MOSI  (via drill 0.35)
  Top 0.152: v15.47,33.81 20.19,33.81 21.64,35.26 22.48,35.26 v22.86,34.87
  Bottom 0.152: v15.47,33.81 13.72,33.81 11.43,31.52 CAN_SERIAL.14 | v22.86,34.87 25.45,34.87 26.06,35.48 26.06,36.02 CONTROL.15
N$1
  Bottom 0.152: IC1.12 34.29,19.33 33.68,18.72 33.68,18.64 33.45,18.41 31.32,18.41 24.54,25.2 24.54,27.41 CONTROL.28
N$2
  Bottom 0.152: IC1.13 33,19.41 32.39,20.02 32.39,20.09 29.34,23.14 29.11,23.14 25.38,26.87 25.38,27.41 CONTROL.27
N$3  (via drill 0.35)
  Top 0.203: v64.92,24.74 76.58,24.74 76.89,24.44 83.13,24.44 85.04,26.34 85.04,26.64 D14.7 | v45.8,38.99 v42.52,35.71
  Bottom 0.203: R13.2 62.25,23.29 63.47,23.29 v64.92,24.74 64.92,24.82 63.86,25.88 63.86,38.46 60.12,42.19 50.37,42.19 47.17,38.99 v45.8,38.99 | v42.52,35.71 36.96,35.71 35.13,33.88 34.29,33.88 DISP1.11
N$4  (via drill 0.35)
  Top 0.203: v74.75,13.23 87.63,26.11 D14.6 | v60.96,27.41 64.92,23.44 v64.92,19.33
  Bottom 0.203: 65.11,19.14 65.38,19.41 68.58,19.41 v74.75,13.23 | 65.11,19.14 62.94,16.97 62.25,16.97 R14.2 | v60.96,27.41 54.56,33.81 44.5,33.81 DISP1.7 | 65.11,19.14 v64.92,19.33
N$5  (via drill 0.35)
  Top 0.203: v45.8,20.55 45.8,18.64 39.39,12.24 39.39,11.86 DISP1.4
  Bottom 0.203: v45.8,20.55 46.86,21.62 53.95,21.62 55.55,23.22 58.37,23.22 R15.2 | D14.4 85.04,11.41 78.41,4.77 78.41,4.7 77.88,4.17 47.24,4.17 44.2,7.21 44.2,7.75 41.76,10.19 41.07,10.19 39.39,11.86 DISP1.4
N$6
  Bottom 0.203: D14.2 80.01,11.41 78.41,9.8 77.11,9.8 70.03,16.89 66.06,16.89 R16.2 65.99,16.89 63.02,13.92 48.39,13.92 47.7,14.6 37.87,14.6 35.13,11.86 DISP1.2
N$7  (via drill 0.35)
  Top 0.203: v61.04,20.02 v59.82,20.02 59.82,19.94 v54.48,14.6
  Bottom 0.203: v59.82,20.02 58.45,18.64 R17.2 | v61.04,20.02 68.89,20.02 D14.1 | DISP1.1 32.54,11.86 35.66,14.99 47.85,14.99 48.23,14.6 v54.48,14.6
N$8  (via drill 0.35)
  Top 0.203: v48.31,43.87 45.03,40.59 43.28,40.59 36.88,34.19 36.88,33.88 DISP1.10
  Bottom 0.203: D14.9 80.01,26.72 77.95,28.78 71.17,28.78 R18.2 71.09,28.85 67.36,32.59 67.36,39.9 63.4,43.87 v48.31,43.87
N$9  (via drill 0.35)
  Top 0.203: v46.1,16.43 41.91,12.24 DISP1.5 | v59.82,20.93 v61.04,22.15
  Bottom 0.203: v46.1,16.43 46.79,16.43 49,18.64 54.56,18.64 R19.2 54.71,18.64 56.16,18.64 58.45,20.93 v59.82,20.93 | v61.04,22.15 67.59,22.15 72.09,26.64 77.42,26.64 D14.10
N$10
  Bottom 0.203: R23.2 71.86,39.37 84.12,27.1 84.12,14.99 87.63,11.48 D14.5 87.63,11.41 80.01,3.78 47.09,3.78 43.81,7.06 43.81,7.59 42.22,9.2 40.31,9.2 37.64,11.86 DISP1.3
N$11
  Bottom 0.203: Q1.3 22.86,40.59 24.16,40.59 28.5,36.25 28.96,36.25 31.32,33.88 31.7,33.88 DISP1.12
N$12  (via drill 0.35)
  Top 0.203: v43.74,37.85 41.53,35.64 40.77,35.64 39.39,34.27 39.39,33.88 DISP1.9
  Bottom 0.203: Q2.3 53.42,39.37 50.75,36.7 44.88,36.7 v43.74,37.85
N$13  (via drill 0.35)
  Top 0.203: v45.11,37.39 41.91,34.19 DISP1.8
  Bottom 0.203: Q3.3 64.77,38.07 60.27,42.57 48.46,42.57 45.11,39.22 v45.11,37.39
N$14
  Top 0.203: Q4.3 49.53,38.61 49.45,38.53 49.45,20.85 49.76,20.55 49.76,17.5 44.5,12.24 44.5,11.86 DISP1.6
N$15
  Bottom 0.203: Q5.3 78.18,5.08 82.53,9.42 82.53,11.41 D14.3 82.53,11.48 82.53,26.64 D14.8
N$18  (via drill 0.35)
  Top 0.152: v28.73,35.56 v29.64,36.47
  Bottom 0.152: v28.73,35.56 29.34,34.95 29.34,33.43 28.88,32.97 28.42,32.97 CONTROL.19 | U1.24 30.94,41.88 28.96,41.88 27.86,40.79 27.86,38.25 v29.64,36.47
N$19
  Bottom 0.152: U1.23 30.94,41.35 28.96,41.35 28.42,40.82 28.42,38.91 32.92,34.42 32.92,33.35 30.17,30.61 28.42,30.61 CONTROL.22
N$20
  Bottom 0.152: U1.1 31.7,42.65 25.53,42.65 24.46,41.58 20.5,41.58 16.99,38.07 16.99,32.21 18.97,30.23 18.97,29.31 19.28,29.01 19.81,29.01 CONTROL.1
N$28  (via drill 0.35)
  Top 0.152: v43.51,30.76 v44.73,30.76
  Bottom 0.152: v44.73,30.76 55.78,30.76 61.49,25.04 62.18,25.04 R13.1 | v43.51,30.76 40.69,30.76 39.39,29.46 39.39,28.93 IC1.21
N$29
  Bottom 0.152: R14.1 62.18,18.57 62.18,18.26 60.12,16.2 60.12,15.82 59.82,15.52 48.31,15.52 48.01,15.82 45.8,15.82 45.11,16.51 45.11,24.36 40.61,28.85 IC1.22
N$30
  Bottom 0.152: IC1.23 41.91,28.78 48.69,22 53.8,22 56.77,24.97 58.37,24.97 R15.1
N$31
  Bottom 0.152: R16.1 65.99,18.57 65.3,18.57 61.95,15.21 48.16,15.21 47.85,15.52 45.64,15.52 42.52,18.64 42.52,25.65 40,28.17 40,29.62 40.23,29.84 42.37,29.84 43.13,29.08 43.13,28.93 IC1.24
N$32  (via drill 0.35)
  Top 0.152: v50.98,28.93 v52.2,27.71
  Bottom 0.152: v52.2,27.71 57.91,27.71 60.43,25.2 60.43,19.25 58.45,17.27 58.45,16.97 R17.1 | v50.98,28.93 50.52,28.93 49,30.45 45.87,30.45 44.5,29.08 44.5,28.93 IC1.25
N$33
  Bottom 0.152: IC1.26 45.72,29.01 46.86,30.15 48.84,30.15 50.67,28.32 57.76,28.32 60.73,25.35 60.73,23.37 61.57,22.53 63.25,22.53 64.77,24.05 66.52,24.05 69.49,27.03 71.09,27.03 R18.1
N$46  (via drill 0.35)
  Top 0.152: v53.49,22.61 v53.49,17.96
  Bottom 0.152: v53.49,17.96 53.57,17.96 54.56,16.97 R19.1 | v53.49,22.61 53.49,25.04 48.69,29.84 47.85,29.84 46.94,28.93 IC1.27
N$47
  Bottom 0.152: R23.1 64.47,39.37 60.58,43.26 47.24,43.26 43.81,39.83 43.43,39.83 43.13,39.52 43.13,32.05 44.12,31.06 44.12,29.92 43.81,29.62 43.81,28.17 43.97,28.02 47.47,28.02 48.31,28.85 IC1.28
N$48  (via drill 0.35)
  Top 0.152: v49.07,20.32 45.87,23.52 39.55,23.52 26.9,36.17 26.9,41.2 25.53,42.57 24.16,42.57 Q1.2
  Bottom 0.152: v49.07,20.32 48.31,19.56 48.31,19.41 IC1.1
N$49  (via drill 0.35)
  Top 0.152: v61.19,26.26 v59.82,24.89
  Bottom 0.152: v59.82,24.89 59.82,22.84 57.91,20.93 48.46,20.93 47.62,20.09 47.62,20.02 47.02,19.41 IC1.2 | v61.19,26.26 61.19,26.72 61.57,27.1 61.57,37.46 59.74,39.29 59.74,41.27 Q2.2
N$50  (via drill 0.35)
  Top 0.152: v58.67,26.03 63.7,31.06 65.99,31.06 Q3.2
  Bottom 0.152: v58.67,26.03 58.75,26.03 59.21,25.58 59.21,22.68 57.76,21.23 47.47,21.23 46.33,20.09 46.33,20.02 45.72,19.41 IC1.3
N$51  (via drill 0.35)
  Top 0.152: v44.42,24.13 44.42,29.54 48.08,33.2 48.08,39.98 49.3,41.2 49.91,41.2 49.99,41.27 Q4.2
  Bottom 0.152: v44.42,24.13 44.42,19.41 IC1.4
N$52  (via drill 0.35)
  Top 0.152: v44.12,17.96 40.16,13.99 v40.16,13.92
  Bottom 0.152: v44.12,17.96 43.2,18.87 43.2,19.33 IC1.5 | v40.16,13.92 47.85,13.92 52.65,9.12 76.58,9.12 78.72,6.98 Q5.2
N$53
  Bottom 0.152: D1.K 11.96,46.46 28.96,46.46 32.23,43.18 32.23,42.72 U1.2
N$54
  Bottom 0.152: U1.3 32.77,42.72 32.77,43.18 29.19,46.76 17.98,46.76 16.54,48.21 D2.K
N$55
  Bottom 0.152: U1.4 33.22,42.72 33.22,43.18 29.34,47.07 24,47.07 22.86,48.21 D3.K
N$56
  Bottom 0.152: D4.K 33.76,43.71 33.76,42.72 U1.5
N$57
  Bottom 0.152: CAN_INTERFACE.1 16.31,12.09 17.15,12.93 17.15,21.23 16.54,21.84 CAN_SERIAL.1
N$58
  Bottom 0.152: CAN_SERIAL.2 15.24,16.89 16.23,15.9 CAN_INTERFACE.4
N$59
  Bottom 0.152: D5.K 34.29,46.99 34.29,42.72 U1.6
N$60
  Bottom 0.152: U1.7 35.13,41.96 35.66,41.96 41.91,48.21 D6.K
N$61
  Bottom 0.152: U1.8 35.13,41.43 40.84,41.43 47.62,48.21 48.23,48.21 D7.K
N$62  (via drill 0.35)
  Top 0.152: v47.17,46.84 47.62,46.38 53.03,46.38 54.56,47.9 54.56,48.21 D8.K
  Bottom 0.152: v47.17,46.84 41.22,40.89 35.13,40.89 U1.9
N$63
  Bottom 0.152: U1.10 35.13,40.44 41.68,40.44 48.31,47.07 59.82,47.07 60.96,48.21 D9.K
N$64
  Bottom 0.152: U1.11 35.13,39.9 41.61,39.9 43.59,41.88 45.42,41.88 49.99,46.46 65.53,46.46 67.28,48.21 D10.K
N$65  (via drill 0.35)  (1 unrouted)
  Top 0.406: D11.K 72.95,48.26 71.66,46.96 57.74,46.96 55.15,49.55 45.18,49.55 44.42,48.8 44.42,46.71 v36.83,39.12
  Bottom 0.406: v36.83,39.12 36.56,39.38 U1.12
N$66  (via drill 0.35)
  Top 0.152: v45.11,42.49 v43.89,41.27
  Bottom 0.152: v43.89,41.27 41.12,38.51 34.45,38.51 U1.13 | v45.11,42.49 45.57,42.49 49.84,46.76 61.57,46.76 64.24,49.43 78.87,49.43 80.01,48.29 D12.K
N$67  (via drill 0.35)
  Top 0.152: v43.74,39.22 v42.52,38
  Bottom 0.152: v42.52,38 31.39,38 30.25,39.14 30.25,39.6 30.48,39.83 30.94,39.83 U1.20 | v43.74,39.22 44.58,39.22 48.31,42.95 60.43,42.95 65.15,38.23 65.15,30.15 65.99,29.31 65.99,25.04 R24.1
OSC1
  Bottom 0.152: 7.62,16.05 4.57,16.05 3.81,15.29 Y1.2 | 7.62,16.05 10.13,16.05 C2.2 | 7.62,16.05 CAN_SERIAL.8
OSC2
  Bottom 0.152: C3.2 12.65,16.13 12.65,17.27 8.91,21.01 8.91,21.84 CAN_SERIAL.7 8.84,21.92 8,22.76 5.94,22.76 3.81,20.62 Y1.1
PARTY1  (via drill 0.35)
  Top 0.152: v24.23,37.24 25.38,37.24 41.45,21.16 46.1,21.16 49.07,18.19 v49.07,17.8 | v59.51,16.13 62.56,16.13 70.18,8.51 70.18,8.43 70.94,7.67 71.25,7.67 PARTY1.2
  Bottom 0.152: v24.23,37.24 23.62,37.85 22.78,37.85 22.17,37.24 22.17,36.09 CONTROL.10 | v49.07,17.8 52.35,17.8 54.03,16.13 v59.51,16.13
PARTY2  (via drill 0.35)
  Top 0.152: v30.33,30 v23.09,37.24
  Bottom 0.152: v23.09,37.24 22.94,37.08 22.94,36.09 CONTROL.11 | v30.33,30 30.33,28.78 36.2,22.91 36.2,18.03 30.56,12.39 30.56,11.33 33.07,8.81 40.92,8.81 42.06,7.67 PARTY2.2
RESET  (via drill 0.35)
  Top 0.152: v24.38,10.64 25.22,10.64 27.89,7.98 27.89,7.67 PROGRAM.3
  Bottom 0.152: 16.5,7.94 17.6,6.83 20.5,6.83 20.88,7.21 20.88,7.82 23.7,10.64 v24.38,10.64 | 16.5,7.94 16.46,7.98 14.02,7.98 R21.2 | CAN_SERIAL.17 15.24,31.75 16.08,32.59 16.08,35.03 15.77,35.33 11.51,35.33 8.31,32.13 8.31,30.76 16.31,22.76 16.92,22.76 17.45,22.23 17.45,8.89 16.5,7.94 | CONTROL.29 23.77,27.41 23.77,16.13 27.89,12.01 27.89,7.67 PROGRAM.3
RPADDLE  (via drill 0.35)
  Top 0.152: v29.41,24.97 29.57,24.97 39.01,15.52 v39.01,13.92
  Bottom 0.152: v29.41,24.97 26.97,27.41 CONTROL.25 | v39.01,13.92 40.69,12.24 40.69,11.41 41.53,10.57 43.74,10.57 45.49,8.81 47.24,8.81 RPADDLE.2
RX  (via drill 0.35)
  Top 0.152: v24.08,6.22 22.86,7.44 PROGRAM.1
  Bottom 0.152: v24.08,6.22 25.68,6.22 26.59,7.14 26.59,12.85 22.94,16.51 22.94,27.41 CONTROL.30
SCK  (via drill 0.35)
  Top 0.152: v17.6,34.72 v15.47,34.72
  Bottom 0.152: v15.47,34.72 13.41,34.72 10.21,31.52 CAN_SERIAL.13 | v17.6,34.72 18.75,34.72 19.13,35.1 20.57,35.1 21.72,33.96 26.36,33.96 26.9,34.49 28.42,34.49 CONTROL.17
SS  (via drill 0.35)
  Top 0.152: v14.55,30.38 14.55,34.72 v17.6,37.77
  Bottom 0.152: v14.55,30.38 14.02,30.91 14.02,31.45 CAN_SERIAL.16 | v17.6,37.77 21.03,37.77 21.41,38.15 24.23,38.15 25.3,37.08 25.3,36.09 CONTROL.14
T/S-TOOGLE  (via drill 0.35)
  Top 0.152: v32.84,20.55 32.84,18.34 38.41,12.78 38.41,12.62 38.18,12.39 38.18,11.33 39.47,10.03 v45.19,10.03
  Bottom 0.152: v32.84,20.55 29.95,23.44 29.26,23.44 26.14,26.57 26.14,27.41 CONTROL.26 | v45.19,10.03 51.28,10.03 52.5,8.81 62.48,8.81 T/S-TOOGLE.2
TX
  Bottom 0.152: PROGRAM.2 25.6,7.82 25.6,13.39 22.17,16.81 22.17,27.41 CONTROL.31
VCC  (via drill 0.35)  (1 unrouted)
  Top 0.406: D8.A v50.29,48.26
  Bottom 0.406: C6.1 12.19,19.02 12.19,18.49 v14.1,16.59 16.08,14.6 CAN_INTERFACE.3 15.93,14.53 14.02,12.62 14.02,9.8 R21.1 | IC1.9 v38.1,22.76 38.1,26.11 35.59,28.63 35.59,28.85 IC1.18 | 20.57,31.29 20.88,30.99 20.88,28.55 20.57,28.24 19.05,28.24 16.54,30.76 16.54,31.45 CAN_SERIAL.18 16.54,31.6 16.54,35.26 8.84,42.95 8.84,48.82 9.91,49.89 50.29,49.89 | 20.57,31.29 19.89,31.29 CONTROL.4 | 20.88,32.59 20.57,32.89 19.89,32.89 CONTROL.6 | 20.88,32.59 20.88,31.67 20.65,31.45 20.57,31.29 | CONTROL.18 28.42,33.73 26.82,33.73 25.76,32.66 21.03,32.66 20.88,32.59 | v81.31,39.14 81.31,48.82 80.24,49.89 50.29,49.89 | 30.37,40.39 30.36,40.39 30.1,40.39 29.97,40.13 v29.46,39.62 | v50.29,48.26 50.29,49.89
  pour Top: 0,53.34 0,0 93.98,0 93.98,53.34